# EAGLE design WiFiGeiger (EAGLE 7.7.0)
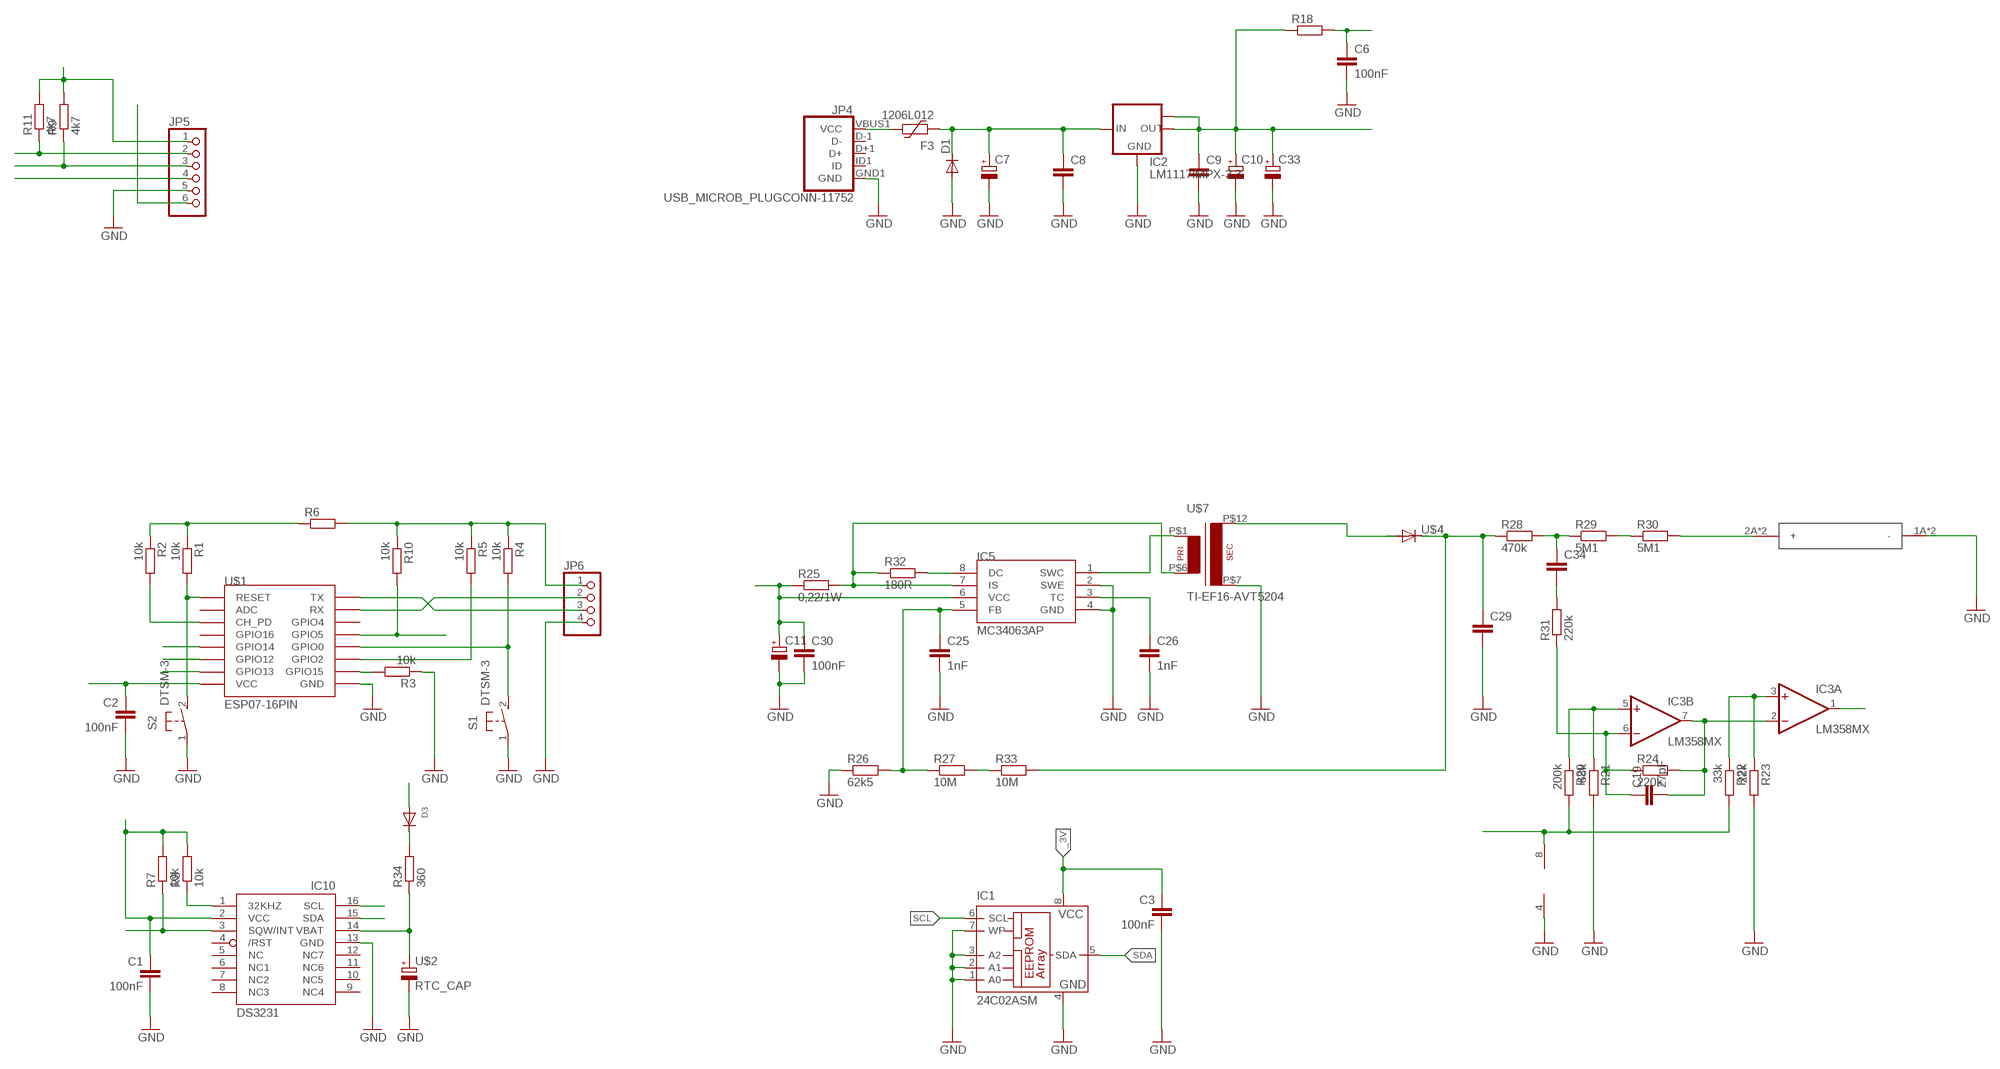
[diagram p0: schematic, sheet 1]

## Parts
C1  100nF  C-EUC0603  [C0603]
C2  100nF  C-EUC0603  [C0603]
C3  100nF  C-EUC0603  [C0603]
C6  100nF  C-EUC0603  [C0603]
C7  CPOL-EUSMCC  [SMC_C]
C8  C-EUC1206  [C1206]
C9  C-EUC1206  [C1206]
C10  CPOL-EUSMCC  [SMC_C]
C11  CPOL-EUSMCE  [SMC_E]
C19  27pF  C-EUC0603  [C0603]
C25  1nF  C-EUC0603  [C0603]
C26  1nF  C-EUC0603  [C0603]
C29  C-EU225-113X268  [C225-113X268]
C30  100nF  C-EUC0603  [C0603]
C33  CPOL-EUSMCB  [SMC_B]
C34  C-EU050-024X044  [C050-024X044]
D1  DIODE-SMB  [SMB]
D3  DIODESMA  [SMADIODE]
F3  1206L012  [1206L]
IC1  24C02ASM  [SO-08M]
IC2  LM1117IMPX-3.3  [SOT223]
IC3  LM358MX  [SO08]
IC5  MC34063AP  [DIL08]
IC10  DS3231/SO  [SO16W]
JP4  USB_MICROB_PLUGCONN-11752  [USB-B-MICRO-SMD_V03]
JP5  PINHD-1X6  [1X06]
JP6  PINHD-1X4  [1X04]
R1  10k  R-EU_R0603  [R0603]
R2  10k  R-EU_R0603  [R0603]
R3  10k  R-EU_R0603  [R0603]
R4  10k  R-EU_R0603  [R0603]
R5  10k  R-EU_R0603  [R0603]
R6  R-EU_R2010  [R2010]
R7  10k  R-EU_R0603  [R0603]
R8  10k  R-EU_R0603  [R0603]
R9  4k7  R-EU_R0603  [R0603]
R10  10k  R-EU_R0603  [R0603]
R11  4k7  R-EU_R0603  [R0603]
R18  R-EU_R1206  [R1206]
R20  200k  R-EU_R0603  [R0603]
R21  68k  R-EU_R0603  [R0603]
R22  33k  R-EU_R1206  [R1206]
R23  22k  R-EU_R0603  [R0603]
R24  220k  R-EU_R0603  [R0603]
R25  0,22/1W  R-EU_R2010  [R2010]
R26  62k5  R-EU_R1206  [R1206]
R27  10M  R-EU_R2512  [R2512]
R28  470k  R-EU_R2512  [R2512]
R29  5M1  R-EU_R2512  [R2512]
R30  5M1  R-EU_R2512  [R2512]
R31  220k  R-EU_R0805  [R0805]
R32  180R  R-EU_R0805  [R0805]
R33  10M  R-EU_R2512  [R2512]
R34  360  R-EU_R0603  [R0603]
S1  DTSM-3  [DTSM-3]
S2  DTSM-3  [DTSM-3]
U$1  ESP07-16PIN  [ESP07-16PIN]
U$2  RTC_CAP  [RTC_CAP]
U$4  DIODE-MELF-MLL41  [MELF-MLL41]
U$5  STS5  [GEIGERTUBE]
U$7  TI-EF16-AVT5204  [EF16-K-H-12P-12,5]

## Nets
3V: JP6.1 R4.1 R5.1 R6.2 R10.1
_3V: C1.1 C2.1 C3.1 C9.1 C10.+ C33.+ D3.A IC1.8(VCC) IC2.2(OUT) IC2.TAB(OUT1) IC10.2(VCC) JP5.1 R1.1 R2.1 R6.1 R7.2 R8.2 R9.2 R11.2 R18.1 U$1.VCC
A_3V: C6.1 IC3.8(P:V+) R18.2 R20.2 R22.2
CPM: IC3.1(A:OUT) R10.2 U$1.GPIO5
GND: C1.2 C2.2 C3.2 C6.2 C7.- C8.2 C9.2 C10.- C11.- C25.2 C26.2 C29.2 C30.2 C33.- D1.A IC1.1(A0) IC1.2(A1) IC1.3(A2) IC1.4(GND) IC1.7(WP) IC2.1(GND) IC3.4(P:V-) IC5.2(SWE) IC5.4(GND) IC10.13(GND) JP4.GND1(GND) JP5.5 JP6.4 R3.1 R21.2 R23.2 R26.1 S1.1 S2.1 U$1.GND U$2.P$2(-) U$5.1A(-) U$5.1B(-) U$7.P$7(P7)
HV: C29.1 R28.1 R33.2 U$4.C
IO_INT: JP5.4
N$2: R1.2 S2.2 U$1.REST(RESET)
N$3: R2.2 U$1.CH_PD
N$4: IC5.7(IS) R25.2 R32.1 U$7.P$6(P6)
N$5: C19.1 IC3.6(B:-IN) R24.1 R31.1
N$6: R3.2 U$1.GPIO15
N$7: R4.2 S1.2 U$1.GPIO0
N$8: C19.2 IC3.2(A:-IN) IC3.7(B:OUT) R24.2
N$9: R5.2 U$1.GPIO2
N$11: C26.1 IC5.3(TC)
N$12: IC10.14(VBAT) R34.1 U$2.P$1(+)
N$13: IC10.1(32KHZ) R8.1
N$14: F3.1 JP4.VBUS1(VCC)
N$15: JP6.3 U$1.TX
N$17: D3.C R34.2
N$19: IC3.5(B:+IN) R20.1 R21.1
N$20: IC3.3(A:+IN) R22.1 R23.1
N$21: U$4.A U$7.P$12(P12)
N$23: JP6.2 U$1.RX
N$24: C25.1 IC5.5(FB) R26.2 R27.1
N$25: R30.2 U$5.2A(+) U$5.2B(+)
N$26: R29.2 R30.1
N$27: C34.1 R28.2 R29.1
N$28: C34.2 R31.2
N$33: IC5.1(SWC) U$7.P$1(P1)
N$34: IC5.8(DC) R32.2
N$35: R27.2 R33.1
SCL: IC1.6(SCL) IC10.16(SCL) JP5.3 R9.1 U$1.GPIO12
SDA: IC1.5(SDA) IC10.15(SDA) JP5.2 R11.1 U$1.GPIO13
SQW: IC10.3(SQW/INT) R7.1 U$1.GPIO14
VBUS: C7.+ C8.1 C11.+ C30.1 D1.C F3.2 IC2.3(IN) IC5.6(VCC) JP5.6 R25.1
Unconnected: IC10.4(/RST) IC10.5(NC) IC10.6(NC1) IC10.7(NC2) IC10.8(NC3) IC10.9(NC4) IC10.10(NC5) IC10.11(NC6) IC10.12(NC7) JP4.D+1(D+) JP4.D-1(D-) JP4.ID1(ID) U$1.ADC U$1.GPIO4 U$1.GPIO16

## Library data of the parts
C1-C3 C6 C8 C9 C19 C25 C26 C29 C30 C34 = rcl:C-EU: CAPACITOR, European symbol
C7 C10 C11 C33 = rcl:CPOL-EU: POLARIZED CAPACITOR, European symbol
D1 U$4 = diode:DIODE-: DIODE
D3 = adafruit:DIODE: Diode SMADIODE - SMA Surface Mount Package 20V 1A Schottky Diode Digikey: 641-1014-6-ND DO-1N4148 - Through Hole Small Current Diode SOD-123 20V 1 A (.5mV Vf) Schottky Diode - Digikey: MBRX120TPMSCT-ND SOD-323 10V 570mA (.38mV Vf, 3ns) Schottky Diode - Digikey: ZLLS410CT-ND SOD-523 30V 30mA Schottky Diode (RB751S-40TE61) - Digikey: RB751S-40TE61CT-ND SOT23-R/W - SOT23 Package (R = Solder Paste/Reflow Ovens, W = Hand-Soldering) BAT54Film 40V 300mA - Digikey: 497-7162-1-ND
F3 = polyfuse-smd_10:?: Polyfuse Resettable PTC Source: http://www.littelfuse.com/products/resettable-ptcs.aspx; MF: Littelfuse; MPN: 1206L012; OC_FARNELL: 1596988; OC_NEWARK: 05M2298
IC1 = microchip:24*: Serial EEPROM I2C; MF: MICROCHIP; MPN: 24C02C/SN; OC_FARNELL: 1084339; OC_NEWARK: 96K4065
IC2 = lm1117:LM1117IMPX-*
IC3 = linear:LM358: OP AMP also LM158; LM258; LM2904 Source: http://cache.national.com/ds/LM/LM158.pdf
IC5 = mc34063:MC34063
IC10 = adafruit:DS3231
JP4 = SparkFun-Connectors:USB_MICROB_PLUG: USB Micro-B connectors Some male, some female. Watch your step!; PROD_ID: CONN-11752
JP5 = pinhead:PINHD-1X6: PIN HEADER
JP6 = pinhead:PINHD-1X4: PIN HEADER
R1-R11 R18 R20-R34 = rcl:R-EU_: RESISTOR, European symbol
S1 S2 = switch-tact:DTSM-3
U$1 = esp8266modules:ESP07-16PIN: ESP8266 Wifi module 07 - 16 pins; DIMENSIONS: 22.0 x 16.0 mm; PINS: 16; PITCH: 0.078" / 2 mm
U$2 = custom:RTC_CAP
U$5 = mw:STS5
U$7 = trafo:TI-EF16-AVT5204

## Board
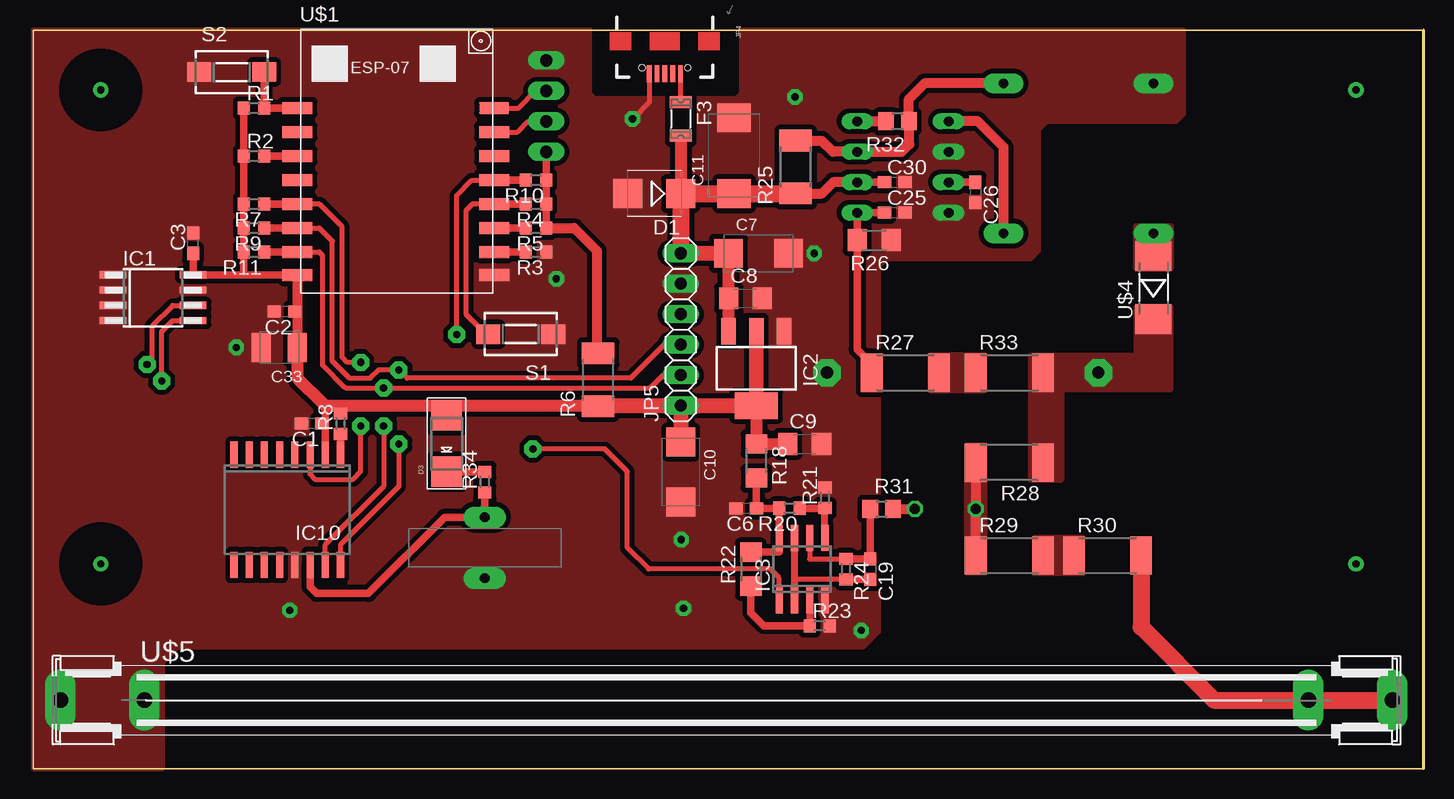
[diagram p1: board, top side]
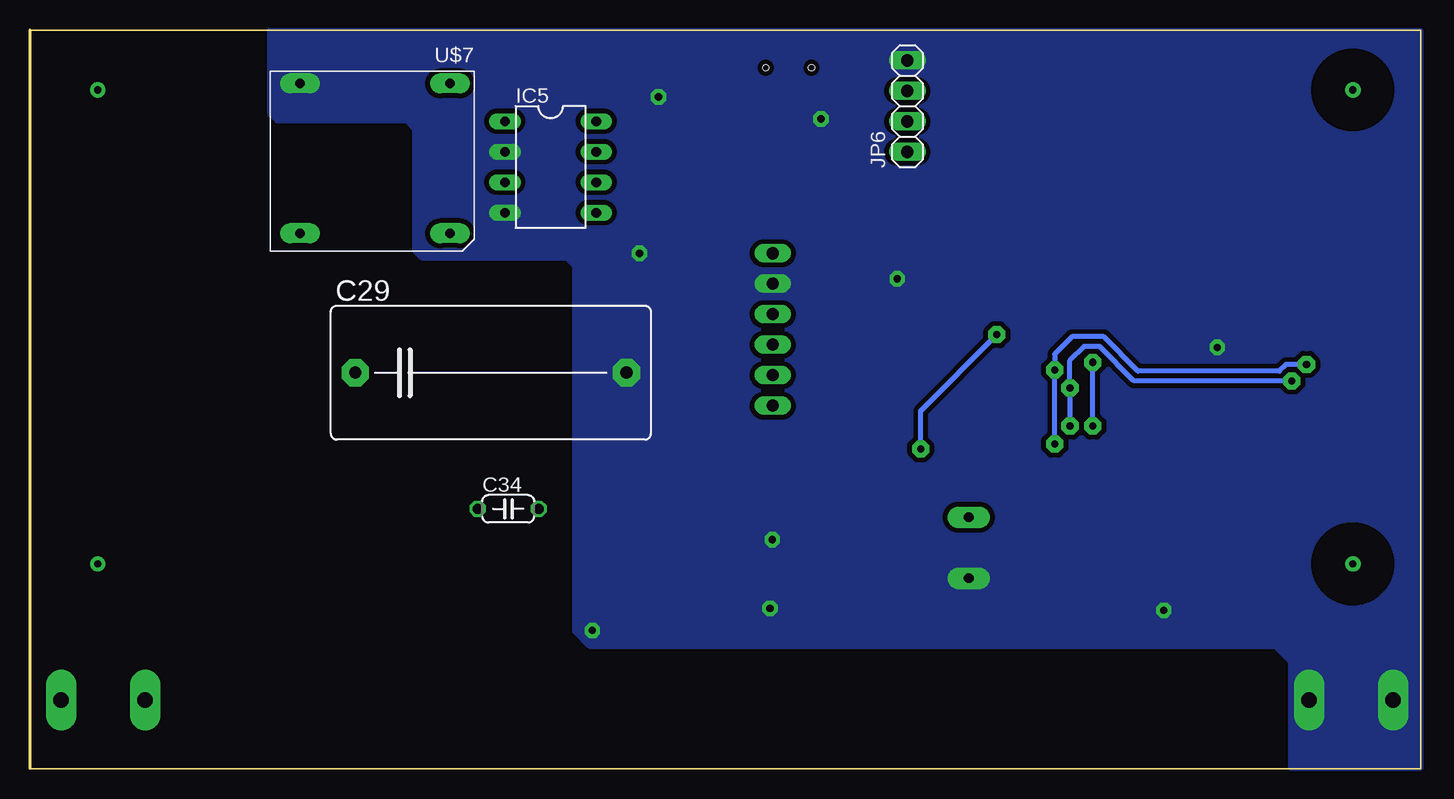
[diagram p2: board, bottom side, seen from below]

Size 115.88 x 61.6 mm. Coordinates in mm from the lower left corner, seen from the top.
Outline: 0,0 115.88,0 115.88,61.6 0,61.6 0,0
Copper layers (1*16): Top 0.035mm / dielectric 1.5mm / Bottom 0.035mm
Design rules "default *": minimum track width 10mil, minimum drill 24mil, track to track 8mil, track to pad 8mil, pad to pad 8mil, via to via 8mil, smd to smd 8mil, copper to edge 0mil, drill to drill 8mil, minimum pad ring 10mil, minimum via ring 8mil, stop-mask expansion 4mil, vias tented up to drill 0mil, thermal gap 10mil
tRestrict: area 2.6,14 to 8.7,20.1; area 2.6,53.5 to 8.7,59.6; area 47,56.5 to 58.4,61.6
bRestrict: area 2.6,14 to 8.7,20.1; area 2.6,53.5 to 8.7,59.6

### Footprints (pad centres in the part's own frame; a part is rotated, then mirrored left to right if it is on the bottom)
C0603 = smd 1.1 x 1: 1 -0.85,0; 2 0.85,0
SMC_C = smd 2.4 x 2.4: + -2.5,0; - 2.5,0
C1206 = smd 1.6 x 1.8: 1 -1.4,0; 2 1.4,0
SMC_E = smd 2.4 x 2.8: + -3.15,0; - 3.15,0
C225-113X268 = drill 1.016 pad 2.286 octagon: 1 -11.303,0; 2 11.303,0
SMC_B = smd 1.6 x 2.4: + -1.5,0; - 1.5,0
C050-024X044 = drill 0.813 octagon: 1 -2.54,0; 2 2.54,0
SMB = smd 2.4 x 2.4: A 2.2,0; C -2.2,0
SMADIODE = smd 2.54 x 2.54: A 2.349,0; C -2.349,0
1206L = smd 1 x 1.8: 1 -1.4,0; 2 1.4,0
SO-08M = smd 0.6 x 2.2: 1 -1.905,-3.33; 2 -0.635,-3.33; 3 0.635,-3.33; 4 1.905,-3.33; 5 1.905,3.33; 6 0.635,3.33; 7 -0.635,3.33; 8 -1.905,3.33
SOT223 = smd 1.219 x 2.235: 1 -2.311,-3.099; 2 0,-3.099; 3 2.311,-3.099 | smd 3.6 x 2.2: TAB 0,3.099
SO08 = smd 0.6 x 2.2: 1 -1.905,-2.6; 2 -0.635,-2.6; 3 0.635,-2.6; 4 1.905,-2.6; 5 1.905,2.6; 6 0.635,2.6; 7 -0.635,2.6; 8 -1.905,2.6
DIL08 = drill 0.813 long: 1 -3.81,-3.81; 2 -1.27,-3.81; 3 1.27,-3.81; 4 3.81,-3.81; 5 3.81,3.81; 6 1.27,3.81; 7 -1.27,3.81; 8 -3.81,3.81
SO16W = smd 0.6 x 2.2: 1 -4.445,-4.6; 2 -3.175,-4.6; 3 -1.905,-4.6; 4 -0.635,-4.6; 5 0.635,-4.6; 6 1.905,-4.6; 7 3.175,-4.6; 8 4.445,-4.6; 9 4.445,4.6; 10 3.175,4.6; 11 1.905,4.6; 12 0.635,4.6; 13 -0.635,4.6; 14 -1.905,4.6; 15 -3.175,4.6; 16 -4.445,4.6
USB-B-MICRO-SMD_V03 = smd 1.4 x 0.4: D+1 2.7,0; D-1 2.7,0.65; GND1 2.7,-1.3; ID1 2.7,-0.65; VBUS1 2.7,1.3 | hole 0.5: 2.2,1.9; 2.2,-1.9
1X06 = drill 1.016 long: 1 -6.35,0; 2 -3.81,0; 3 -1.27,0; 4 1.27,0; 5 3.81,0; 6 6.35,0
1X04 = drill 1.016 long: 1 -3.81,0; 2 -1.27,0; 3 1.27,0; 4 3.81,0
R0603 = smd 1 x 1.1: 1 -0.85,0; 2 0.85,0
R2010 = smd 1.8 x 2.7: 1 -2.2,0; 2 2.2,0
R1206 = smd 1.6 x 1.803: 1 -1.422,0; 2 1.422,0
R2512 = smd 1.8 x 3.2: 1 -2.8,0; 2 2.8,0
R0805 = smd 1.3 x 1.5: 1 -0.95,0; 2 0.95,0
DTSM-3 = smd 2 x 1.6: 1 -2.7,0; 2 2.7,0
ESP07-16PIN = smd 2.5 x 1: ADC -8.2,3.8; CH_PD -8.2,1.8; GND 8.2,-8.105; GPIO0 8.2,-2.2; GPIO2 8.2,-4.2; GPIO4 8.2,1.8; GPIO5 8.2,-0.2; GPIO12 -8.2,-4.2; GPIO13 -8.2,-6.2; GPIO14 -8.2,-2.2; GPIO15 8.2,-6.2; GPIO16 -8.2,-0.2; REST -8.2,5.8; RX 8.2,3.8; TX 8.2,5.8; VCC -8.2,-8.105
RTC_CAP = drill 0.8 pad 1.778 long: P$1 0,0; P$2 5.08,0
MELF-MLL41 = smd 2.5 x 3: A 2.625,0; C -2.625,0
GEIGERTUBE = drill 1.321 pad 2.54 long: 1A -10.414,0; 1B -3.414,0; 2A 93.586,0; 2B 100.586,0
EF16-K-H-12P-12,5 = drill 0.8 pad 1.676 long: P$1 0,12.5; P$6 0,0; P$7 12.5,0; P$12 12.5,12.5

### Placement (x,y rotation side)
C1  23.22,28.78 180 top
C2  20.95,38.1 180 top
C3  13.33,43.82 90 top
C6  59.43,21.72 180 top
C7  60.45,42.98 0 top
C8  59.37,39.22 0 top
C9  64.3,27.08 0 top
C10  53.97,24.74 270 top
C11  58.42,51.1 90 top
C19  69.77,16.64 270 top
C25  71.81,46.36 0 top
C26  78.54,48.04 270 top
C29  77.47,33.02 0 bottom
C30  71.81,48.9 0 top
C33  20.52,35.13 180 top
C34  76.02,21.67 0 bottom
D1  51.77,47.95 180 top
D3  34.47,27.1 90 top
F3  53.98,54.18 270 top
IC1  10.01,39.27 270 top
IC2  60.27,33.38 180 top
IC3  64.08,16.64 0 top
IC5  72.49,50.17 270 bottom
IC10  21.18,21.59 180 top
JP4  52.65,60.66 270 top
JP5  53.98,36.63 90 top
JP6  42.76,55.25 90 bottom
R1  18.41,55.08 0 top
R2  18.41,51.08 0 top
R3  41.91,43.08 180 top
R4  41.91,47.08 180 top
R5  41.91,45.08 180 top
R6  47.09,32.44 90 top
R7  18.41,47.08 180 top
R8  25.63,28.78 90 top
R9  18.41,45.08 180 top
R10  41.91,49.08 180 top
R11  18.41,43.08 180 top
R18  60.27,25.65 270 top
R20  63.04,21.72 180 top
R21  65.99,22.58 90 top
R22  59.82,16.64 90 top
R23  65.56,11.91 0 top
R24  67.74,16.64 270 top
R25  63.55,50.17 90 top
R26  70.1,44.07 180 top
R27  72.69,33.02 0 top
R28  81.36,25.53 180 top
R29  81.36,17.78 0 top
R30  89.53,17.78 0 top
R31  70.71,21.67 0 top
R32  72.03,53.98 180 top
R33  81.36,33.02 0 top
R34  37.64,23.9 90 top
S1  40.64,36.22 180 top
S2  16.56,58.09 0 top
U$1  30.23,49.28 0 top
U$2  37.64,20.95 270 top
U$4  93.37,40.11 90 top
U$5  12.7,5.71 0 top
U$7  80.87,57.15 180 bottom

### Tracks (layer width: path | path; a pad name or v marks a point on that pad's centre or on a via)
3V
  Top 0.61: R5.1 R4.1 R10.1 JP6.1
  Top 0.813: R5.1 45.09,45.08 46.99,43.18 46.99,34.74 R6.2
_3V
  Top 0.406: R8.2 25.63,30.01 25.4,30.24 | C1.1 24.16,28.78 24.36,28.57 | C2.1 22.03,38.1
  Top 0.61: IC2.TAB | R1.1 R2.1 R7.2 R9.2 R11.2 17.57,41.17 | U$1.VCC 17.57,41.17 | C33.+ | IC10.2 24.36,28.57 24.36,30.25 24.13,30.48 | D3.A 34.47,30.06 34.29,30.24 | 17.57,41.17 IC1.8 C3.1
  Top 0.813: U$1.VCC 22.03,38.1 C33.+
  Top 0.991: R6.1 47.58,30.24 47.62,30.28
  Top 1.016: C33.+ 22.02,32.59 24.13,30.48 24.37,30.24 25.4,30.24 34.29,30.24 R6.1 | IC2.TAB R18.1 C9.1
  Top 1.219: IC2.TAB IC2.2
  Top 1.27: JP5.1 IC2.TAB | 47.62,30.28 JP5.1 | JP5.1 C10.+
A_3V
  Top 0.599: IC3.8 62.18,21.7 R20.2
  Top 0.61: R18.2 C6.1 R20.2 | R22.2 62.18,18.06 IC3.8
CPM  (via drill 0.6 pad 1.42)
  Top 0.305: IC3.1
  Top 0.406: IC3.1 62.18,15.9 61.44,16.64 51.31,16.64 49.53,18.41 49.53,24.77 47.62,26.67 v41.66,26.67 | v35.31,36.2 35.31,47.8 36.58,49.07 U$1.GPIO5
  Top 0.61: U$1.GPIO5 R10.2
  Bottom 0.406: v41.66,26.67 41.66,29.84 v35.31,36.2
GND  (via drill 0.6 pad 1.27)
  Top 0.399: JP4.GND1 51.35,55.57 v49.96,54.18
  other vias: 54.2,13.38 54.02,19.09 65.09,42.98 63.5,56.01 69.01,11.52 21.39,13.21 43.61,40.84 16.94,35.13
  pour Top (isolate 0.406, rank 2, no thermals): 0,61.6 0,0 10.79,0 10.79,8.89 12.06,10.16 69.21,10.16 70.48,11.43 70.48,41.91 71.12,42.55 83.19,42.55 83.82,43.18 83.82,53.34 84.45,53.98 95.25,53.98 95.88,54.61 95.88,61.6
  pour Bottom (isolate 0.406, no thermals): 0,61.6 0,0 10.79,0 10.79,8.89 12.06,10.16 69.21,10.16 70.48,11.43 70.48,41.91 71.12,42.55 83.19,42.55 83.82,43.18 83.82,53.34 84.45,53.98 95.25,53.98 95.88,54.61 95.88,61.6
HV
  pour Top (isolate 0.406, no thermals): 83.08,34.44 83.08,24.08 85.75,24.08 85.75,31.62 94.84,31.62 94.84,38.53 91.9,38.53 91.9,34.44
N$1
  cutout Top: 52.67,56.08 52.67,52.91 55.28,52.91 55.28,56.08
N$2
  Top 0.61: U$1.REST R1.2 S2.2
N$3
  Top 0.61: R2.2 U$1.CH_PD
N$4
  Top 0.61: 73.02,53.93 R32.1
  Top 0.813: 73.02,53.93 73.02,52.07 72.39,51.44 IC5.7 66.67,51.44 65.74,52.37 R25.2 | U$7.P$6 74.3,57.15 72.98,55.84 R32.1
N$5
  Top 0.406: IC3.6 64.72,17.49 R24.1
  Top 0.61: R24.1 C19.1 69.77,21.66 R31.1
N$6
  Top 0.61: U$1.GPIO15 R3.2
N$7
  Top 0.406: S1.2 37.74,36.22 36.12,37.85 36.12,46.58 36.61,47.08 U$1.GPIO0
  Top 0.61: U$1.GPIO0 R4.2
N$8
  Top 0.406: R24.2 63.45,15.79
  Top 0.599: IC3.7 63.45,15.79 IC3.2
  Top 0.61: C19.2 R24.2
N$9
  Top 0.61: U$1.GPIO2 R5.2
N$11
  Top 0.61: IC5.3 C26.1
N$12
  Top 0.61: IC10.14 23.09,15.16 23.65,14.61 27.94,14.61 34.29,20.95 U$2.P$1 R34.1
N$13
  Top 0.61: R8.1 IC10.1
N$14
  Top 0.399: JP4.VBUS1 53.95,55.6 F3.1
  Top 0.813: 54.08,55.58 F3.1
N$15
  Top 0.406: U$1.TX 40.47,55.08 41.91,56.52 JP6.3
N$17
  Top 0.61: D3.C R34.2
N$19
  Top 0.599: IC3.5 R21.1
  Top 0.61: R20.1 65.98,21.72 R21.1
N$20
  Top 0.599: IC3.3 64.72,11.92 R23.1
  Top 0.61: R23.1 60.91,11.91 59.82,13 R22.1
N$21
  pour Top (isolate 0.406, no thermals): 94.84,45.29 94.84,41.68 91.9,41.68 91.9,45.29
N$23
  Top 0.406: U$1.RX 40.38,53.08 41.28,53.98 JP6.2
N$24
  Top 0.406: 69.85,33.04 R27.1
  Top 0.61: 69.85,33.04 69.85,33.78 68.68,34.95 68.68,44.45 | C25.1 IC5.5 68.68,44.45 | R26.2 68.68,44.45 | 68.68,44.45
N$25
  Top 1.422: R30.2 92.33,11.8 98.42,5.71 U$5.2A U$5.2B
N$26
  pour Top (isolate 0.406, no thermals): 83.41,19.28 83.41,16.28 87.48,16.28 87.48,19.28
N$27
  Top 0.813: R28.2 C34.1 R29.1
  pour Top (no thermals): 77.8,27 79.32,27 79.32,16.31 77.8,16.31
N$28
  Top 0.813: R31.2 C34.2
N$32
  cutout Top: 61.79,48.87 65.31,48.87 65.31,51.46 61.79,51.46
N$33
  Top 0.813: U$7.P$1 80.87,51.84 78.74,53.98 IC5.1
N$34
  Top 0.813: IC5.8 R32.2
N$35
  pour Top (isolate 0.406, no thermals): 74.73,34.49 74.73,31.55 79.32,31.55 79.32,34.49
N$36  (via drill 0.6 pad 1.27)
  other vias: 5.63,56.6
N$37  (via drill 0.6 pad 1.27)
  other vias: 5.63,17.07
N$38  (via drill 0.6 pad 1.27)
  other vias: 110.24,17.07
N$39  (via drill 0.6 pad 1.27)
  other vias: 110.24,56.6
SCL  (via drill 0.6 pad 1.42)
  Top 0.406: U$1.GPIO12 23.86,45.08 24.94,43.99 24.94,33.99 26.36,32.56 28.12,32.56 28.8,33.25 v30.48,33.25 31.17,32.56 49.81,32.56 52.6,35.36 JP5.3 | IC10.16 25.63,18.69 30.48,23.55 v30.48,27.08 | IC1.6 11.63,38.63 9.91,36.91 9.91,34.04 v9.5,33.71
  Top 0.61: R9.1 U$1.GPIO12
  Bottom 0.406: v30.48,27.08 v30.48,33.25 30.48,34.57 29.03,36.02 26.42,36.02 23.55,33.15 11.76,33.15 11.2,33.71 v9.5,33.71
SDA  (via drill 0.6 pad 1.42)
  Top 0.406: U$1.GPIO13 23.85,43.08 24.13,42.8 24.13,33.66 26.04,31.75 v29.21,31.75 51.44,31.75 52.5,32.82 JP5.2 | IC10.15 24.36,18.69 29.21,23.55 v29.21,28.57 | v10.72,32.33 10.72,36.45 11.63,37.36 IC1.5
  Top 0.61: R11.1 U$1.GPIO13
  Bottom 0.406: v29.21,28.57 v29.21,31.75 29.21,34.04 28.04,35.2 26.75,35.2 23.88,32.33 v10.72,32.33
SQW  (via drill 0.6 pad 1.42)
  Top 0.406: IC10.3 23.09,24.54 23.5,24.13 26.67,24.13 27.3,24.77 v27.3,28.57 | v27.3,33.88 26.19,33.88 25.76,34.32 25.76,45.19 23.88,47.07 22.04,47.07 U$1.GPIO14
  Top 0.61: R7.1 U$1.GPIO14
  Bottom 0.406: v27.3,28.57 v27.3,33.88
VBUS
  Top 0.61: IC2.3 | IC5.6 C30.1
  Top 0.813: IC5.6 66.67,48.9 65.74,47.97 R25.1 | 57.95,36.49 IC2.3
  Top 1.016: F3.2 53.98,47.97 D1.C | C7.+ 57.95,39.37 | 57.95,39.37 57.95,36.48 IC2.3 | C8.1 57.97,39.35 57.95,39.37
  Top 1.27: JP5.6 C7.+
  Top 1.422: JP5.6 53.98,47.97 58.41,47.97 C11.+ 63.54,47.96 R25.1